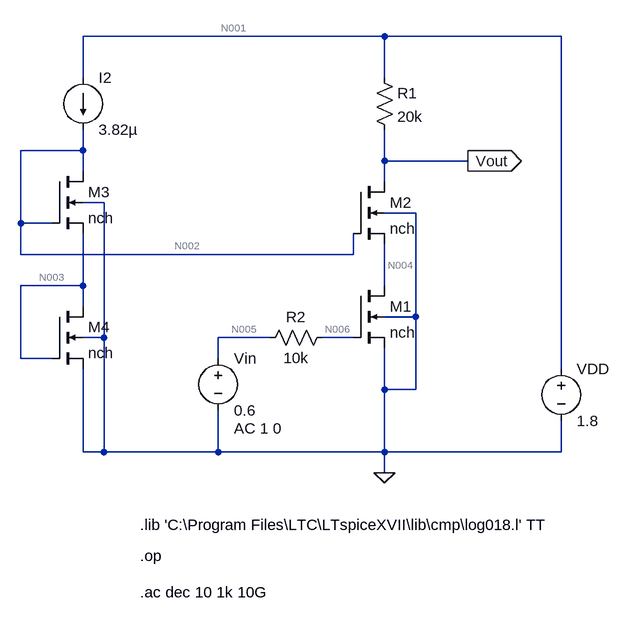
[diagram p0: schematic Ex2.asc]
Ex2.asc, the LTspice schematic file:
Version 4
SHEET 1 880 680
WIRE 224 -272 -240 -272
WIRE 496 -272 224 -272
WIRE -240 -208 -240 -272
WIRE 224 -208 224 -272
WIRE -240 -96 -240 -128
WIRE -240 -96 -336 -96
WIRE 224 -80 224 -128
WIRE 352 -80 224 -80
WIRE -240 -64 -240 -96
WIRE 224 -48 224 -80
WIRE -208 -16 -240 -16
WIRE 272 0 224 0
WIRE -336 16 -336 -96
WIRE -288 16 -336 16
WIRE -336 64 -336 16
WIRE 176 64 176 32
WIRE 176 64 -336 64
WIRE -240 112 -240 32
WIRE -240 112 -336 112
WIRE 224 112 224 48
WIRE -240 144 -240 112
WIRE 272 160 272 0
WIRE 272 160 224 160
WIRE -208 192 -208 -16
WIRE -208 192 -240 192
WIRE 48 192 -32 192
WIRE 176 192 128 192
WIRE -336 224 -336 112
WIRE -288 224 -336 224
WIRE -32 224 -32 192
WIRE 496 240 496 -272
WIRE 224 272 224 208
WIRE 272 272 272 160
WIRE 272 272 224 272
WIRE -240 368 -240 240
WIRE -208 368 -208 192
WIRE -208 368 -240 368
WIRE -32 368 -32 304
WIRE -32 368 -208 368
WIRE 224 368 224 272
WIRE 224 368 -32 368
WIRE 496 368 496 320
WIRE 496 368 224 368
WIRE 224 400 224 368
FLAG 224 400 0
FLAG 352 -80 Vout
IOPIN 352 -80 Out
SYMBOL nmos4 176 112 R0
SYMATTR InstName M1
SYMATTR Value nch
SYMATTR Value2 l=1u w=1u m=10
SYMBOL nmos4 176 -48 R0
SYMATTR InstName M2
SYMATTR Value nch
SYMATTR Value2 l=0.18u w=1u m=10
SYMBOL voltage -32 208 R0
WINDOW 123 24 124 Left 2
WINDOW 39 0 0 Left 0
SYMATTR Value2 AC 1 0
SYMATTR InstName Vin
SYMATTR Value 0.6
SYMBOL voltage 496 224 R0
WINDOW 123 0 0 Left 0
WINDOW 39 0 0 Left 0
SYMATTR InstName VDD
SYMATTR Value 1.8
SYMBOL current -240 -208 R0
WINDOW 123 0 0 Left 0
WINDOW 39 0 0 Left 0
SYMATTR InstName I2
SYMATTR Value 3.82µ
SYMBOL nmos4 -288 -64 R0
SYMATTR InstName M3
SYMATTR Value nch
SYMATTR Value2 l=0.18u w=1u m=1
SYMBOL nmos4 -288 144 R0
SYMATTR InstName M4
SYMATTR Value nch
SYMATTR Value2 l=1u w=1u m=1
SYMBOL res 144 176 R90
WINDOW 0 0 56 VBottom 2
WINDOW 3 32 56 VTop 2
SYMATTR InstName R2
SYMATTR Value 10k
SYMBOL res 208 -224 R0
SYMATTR InstName R1
SYMATTR Value 20k
TEXT -152 480 Left 2 !.lib 'C:\\Program Files\\LTC\\LTspiceXVII\\lib\\cmp\\log018.l' TT
TEXT -152 528 Left 2 !.op
TEXT -152 584 Left 2 !.ac dec 10 1k 10G

The netlist it stands for:
* Ex2.asc
M1 N004 N006 0 0 nch l=1u w=1u m=10
M2 Vout N002 N004 0 nch l=0.18u w=1u m=10
Vin N005 0 0.6 AC 1 0
VDD N001 0 1.8
I2 N001 N002 3.82µ
M3 N002 N002 N003 0 nch l=0.18u w=1u m=1
M4 N003 N003 0 0 nch l=1u w=1u m=1
R2 N006 N005 10k
R1 N001 Vout 20k
.model NMOS NMOS
.model PMOS PMOS
.lib standard.mos
.lib 'C:\Program Files\LTC\LTspiceXVII\lib\cmp\log018.l' TT
.op
.ac dec 10 1k 10G
.backanno
.end

* Results of the author's LTspice run, read from the files saved beside the schematic
* Operating Point, zero values left out:
*   V(n004) = 594.7 mV
*   V(n006) = 600 mV
*   V(vout) = 1.036 V
*   V(n002) = 1.256 V
*   V(n005) = 600 mV
*   V(n001) = 1.8 V
*   V(n003) = 600 mV
*   Id(M3) = 3.82 µA
*   Ib(M3) = -1.879 pA
*   Is(M3) = -3.82 µA
*   Id(M2) = 38.2 µA
*   Ib(M2) = -16.51 pA
*   Is(M2) = -38.2 µA
*   Id(M4) = 3.82 µA
*   Is(M4) = -3.82 µA
*   Id(M1) = 38.2 µA
*   Ib(M1) = -6.047 pA
*   Is(M1) = -38.2 µA
*   I(I2) = 3.82 µA
*   I(R1) = 38.2 µA
*   I(Vdd) = -42.02 µA
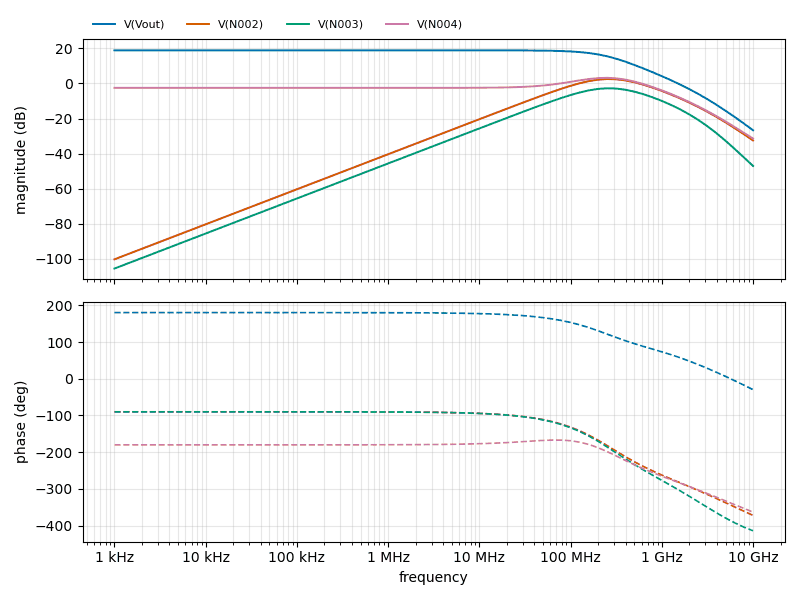
[diagram p1: AC Analysis of Ex2.asc, plotted from the saved traces]
* AC Analysis, 1 run:
*   V(Vout): 18.90 dB at 1 kHz, -26.71 dB at 10 GHz, peak 18.90 dB at 1 kHz, 3 dB below the peak at 231.9 MHz
*   V(N002): -100.40 dB at 1 kHz, -32.52 dB at 10 GHz, peak 2.54 dB at 251.2 MHz, 3 dB below the peak at 114.6 MHz and 604.7 MHz
*   V(N003): -105.66 dB at 1 kHz, -47.09 dB at 10 GHz, peak -2.75 dB at 251.2 MHz, 3 dB below the peak at 114.2 MHz and 592.2 MHz
*   V(N004): -2.50 dB at 1 kHz, -31.43 dB at 10 GHz, peak 3.22 dB at 251.2 MHz, 3 dB below the peak at 81.6 MHz and 575.9 MHz
* From the log:
*   Semiconductor Device Operating Points:
*                           --- BSIM3 MOSFETS ---
*   Name:        m3          m2          m4          m1
*   Model:      nch.9       nch.9       nch.8       nch.8
*   Id:        3.82e-06    3.82e-05    3.82e-06    3.82e-05
*   Vgs:       6.57e-01    6.62e-01    6.00e-01    6.00e-01
*   Vds:       6.57e-01    4.41e-01    6.00e-01    5.95e-01
*   Vbs:      -6.00e-01   -5.95e-01    0.00e+00    0.00e+00
*   Vth:       6.74e-01    6.74e-01    4.81e-01    4.81e-01
*   Vdsat:     6.73e-02    6.88e-02    1.62e-01    1.62e-01
*   Gm:        6.86e-05    6.84e-04    4.42e-05    4.42e-04
*   Gds:       1.92e-06    2.23e-05    2.08e-07    2.10e-06
*   Gmb        1.43e-05    1.44e-04    1.27e-05    1.27e-04
*   Cbd:       0.00e+00    0.00e+00    0.00e+00    0.00e+00
*   Cbs:       0.00e+00    0.00e+00    0.00e+00    0.00e+00
*   Cgsov:     3.59e-16    3.59e-15    3.59e-16    3.59e-15
*   Cgdov:     3.59e-16    3.59e-15    3.59e-16    3.59e-15
*   Cgbov:     3.18e-17    3.18e-16    1.81e-16    1.81e-15
*   dQgdVgb:   1.34e-15    1.36e-14    6.33e-15    6.33e-14
*   dQgdVdb:  -3.57e-16   -3.57e-15   -3.60e-16   -3.60e-15
*   dQgdVsb:  -6.87e-16   -7.18e-15   -5.16e-15   -5.16e-14
*   dQddVgb:  -3.60e-16   -3.60e-15   -3.71e-16   -3.71e-15
*   dQddVdb:   3.59e-16    3.59e-15    3.63e-16    3.63e-15
*   dQddVsb:   4.61e-19    1.04e-17    1.13e-17    1.15e-16
*   dQbdVgb:  -3.04e-16   -3.00e-15   -8.25e-16   -8.25e-15
*   dQbdVdb:   3.41e-19    3.34e-18   -3.62e-19   -3.80e-18
*   dQbdVsb:  -5.66e-17   -6.19e-16   -1.37e-15   -1.37e-14